# Altium schematic sheet VoltageR.SchDoc
size A
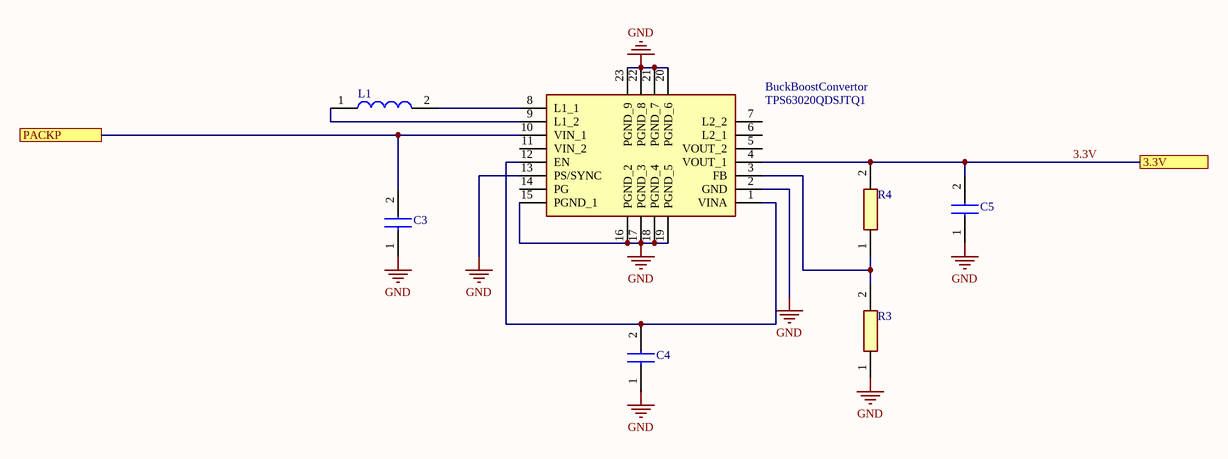
[diagram p0: VoltageR.SchDoc]

## Parts
BuckBoostConvertor  TPS63020QDSJTQ1  [TPS63020QDSJTQ1]
C3  C0603C150K5GAC  [CAPC1608X87N]  (value not drawn)
C4  C0603C150K5GAC  [CAPC1608X87N]  (value not drawn)
C5  C0603C150K5GAC  [CAPC1608X87N]  (value not drawn)
L1  0603CS-47NXGLU  [0603CS82NXGLW]  (value not drawn)
R3  CRCW06034K70JNEA  [RESC1608X50N]  (value not drawn)
R4  CRCW06034K70JNEA  [RESC1608X50N]  (value not drawn)

## Ports
3.3V, PACKP

## Nets
GND: BuckBoostConvertor.2(GND) BuckBoostConvertor.13(PS/SYNC) BuckBoostConvertor.15(PGND_1) BuckBoostConvertor.16(PGND_2) BuckBoostConvertor.17(PGND_3) BuckBoostConvertor.18(PGND_4) BuckBoostConvertor.19(PGND_5) BuckBoostConvertor.20(PGND_6) BuckBoostConvertor.21(PGND_7) BuckBoostConvertor.22(PGND_8) BuckBoostConvertor.23(PGND_9) C3.1 C4.1 C5.1 R3.1
3.3V: BuckBoostConvertor.4(VOUT_1) C5.2 R4.2 ; port 3.3V
PACKP: BuckBoostConvertor.10(VIN_1) C3.2 ; port PACKP
NetBuckBoostConvertor_1: BuckBoostConvertor.1(VINA) BuckBoostConvertor.12(EN) C4.2
NetBuckBoostConvertor_3: BuckBoostConvertor.3(FB) R3.2 R4.1
NetBuckBoostConvertor_8: BuckBoostConvertor.8(L1_1) L1.2
NetBuckBoostConvertor_9: BuckBoostConvertor.9(L1_2) L1.1

Not connected (* = marked no-connect by the designer): BuckBoostConvertor 5(VOUT_2) 6(L2_1) 7(L2_2) 11(VIN_2) 14(PG)

## Library data of the parts
BuckBoostConvertor = TPS63020QDSJTQ1: Integrated Circuit; Manufacturer_Name: Texas Instruments; Datasheet Link: http://www.ti.com/lit/gpn/TPS63020-Q1; Height: 1mm; Manufacturer_Part_Number: TPS63020QDSJTQ1; Arrow Part Number: TPS63020QDSJTQ1; Arrow Price/Stock: https://www.arrow.com/en/products/tps63020qdsjtq1/texas-instruments; Mouser Part Number: 595-TPS63020QDSJTQ1; Mouser Price/Stock: https://www.mouser.co.uk/ProductDetail/Texas-Instruments/TPS63020QDSJTQ1?qs=8%2FmU9qzJpL%252BzpjrehKc87w%3D%3D
C3-C5 = C0603C150K5GAC: Capacitor; Manufacturer_Name: Kemet; Datasheet Link: https://content.kemet.com/datasheets/KEM_C1003_C0G_SMD.pdf; Height: 0.87mm; Manufacturer_Part_Number: C0603C150K5GAC; Mouser Part Number: 80-C0603C150K5GAC; Mouser Price/Stock: https://www.mouser.co.uk/ProductDetail/KEMET/C0603C150K5GAC?qs=Zjfhvh7dXTMDnIuVVWtUUQ%3D%3D
L1 = 0603CS-47NXGLU: Inductor; Manufacturer_Name: COILCRAFT; Datasheet Link: https://www.coilcraft.com/pdfs/0603cs.pdf; Height: 1mm; Manufacturer_Part_Number: 0603CS-47NXGLU; Mouser Part Number: 994-0603CS-47NXGLU; Mouser Price/Stock: https://www.mouser.com/Search/Refine.aspx?Keyword=994-0603CS-47NXGLU
R3 R4 = CRCW06034K70JNEA: Resistor; Manufacturer_Name: Vishay; Datasheet Link: http://www.vishay.com/docs/20035/dcrcwe3.pdf; Height: 0.5mm; Manufacturer_Part_Number: CRCW06034K70JNEA; Arrow Part Number: CRCW06034K70JNEA; Arrow Price/Stock: https://www.arrow.com/en/products/crcw06034k70jnea/vishay; Mouser Part Number: 71-CRCW0603J-4.7K-E3; Mouser Price/Stock: https://www.mouser.co.uk/ProductDetail/Vishay-Dale/CRCW06034K70JNEA?qs=C0xaqriB68jbLUpBrIbing%3D%3D